# Altium project DepSwitches.PrjPCB
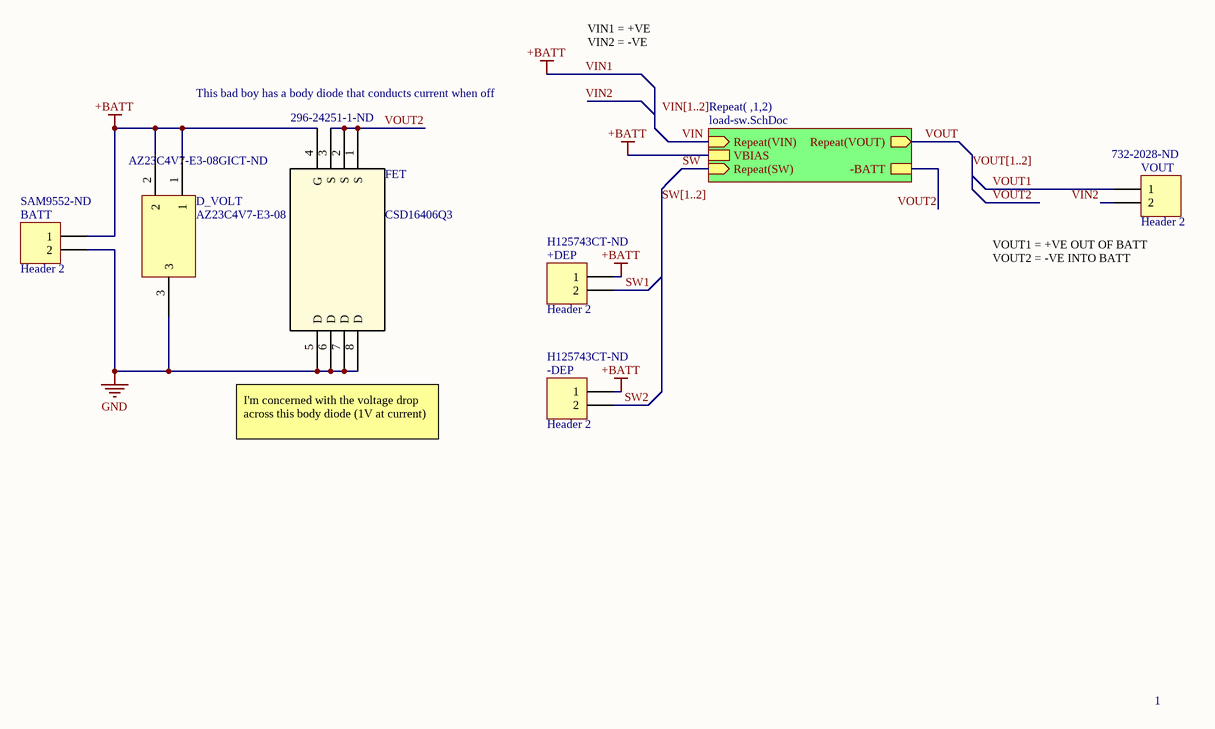
[diagram p0: dep-switches.SchDoc]
ProjectDrawnBy: Jaden Reimer; ProjectRevision: v1.0; ProjectSheetTotal: 2; ProjectTitle: Deployment Switch Prototype PCB
2 sheets, 20 parts. Net scope: hierarchical (ports join the sheet entries above them; power ports are global).
Board file: dep-switches.PcbDoc
Sheets:
  dep-switches.SchDoc
    1 = load-sw.SchDoc
    2 = load-sw.SchDoc

## Sheet dep-switches.SchDoc
size A4

### Parts
+DEP  Header 2  Supplier Part Number 1: H125743CT-ND  [DF13A-2P-1.25H(21)]
-DEP  Header 2  Supplier Part Number 1: H125743CT-ND  [DF13A-2P-1.25H(21)]
BATT  Header 2  [SAM9552-ND]
D_VOLT  AZ23C4V7-E3-08  Supplier Part Number 1: AZ23C4V7-E3-08GICT-ND
FET  CSD16406Q3  Supplier Part Number 1: 296-24251-1-ND  [CSD16406Q3]
VOUT  Header 2  Supplier Part Number 1: 732-2028-ND  [CON2_SCREW_5.00MM_691102710002]

### Sub-sheets
Repeat( ,1,2) = load-sw.SchDoc: Repeat(SW) (in), Repeat(VIN) (in), -BATT, Repeat(VOUT) (out), VBIAS

### Nets
GND: BATT.2 D_VOLT.3 FET.5(D) FET.6(D) FET.7(D) FET.8(D)
VIN1: +DEP.1 -DEP.1 BATT.1 D_VOLT.1 D_VOLT.2 FET.4(G) ; sheet Repeat( ,1,2)/VBIAS  [also labelled +BATT]
SW: sheet Repeat( ,1,2)/Repeat(SW)
SW1: +DEP.2
SW2: -DEP.2
VIN: sheet Repeat( ,1,2)/Repeat(VIN)
VIN2: VOUT.2
VOUT: sheet Repeat( ,1,2)/Repeat(VOUT)
VOUT1: VOUT.1
VOUT2: FET.1(S) FET.2(S) FET.3(S) ; sheet Repeat( ,1,2)/-BATT

### Buses and harness runs
bus SW[1..2]
bus VIN[1..2]
bus VOUT[1..2]

### Notes on the sheet
- This bad boy has a body diode that conducts current when off
- VIN1 = +VE
  VIN2 = -VE
- (near VOUT) VOUT1 = +VE OUT OF BATT
  VOUT2 = -VE INTO BATT
- I'm concerned with the voltage drop across this body diode (1V at current)
- 1
- Labels drawn without touching a wire or pin: VIN[1..2]

### Library data of the parts
+DEP -DEP = Header 2: Header, 2-Pin; Manufacturer: Hirose; Number of Positions: 2; Pitch: 1.25mm; LatestRevisionDate: 17-Jul-2002; LatestRevisionNote: Re-released for DXP Platform.; Publisher: Altium Limited; Supplier 1: Digi-Key; Manufacturer Part Number: DF13A-2P-1.25H(21); Stock 1: 4810; Pricing 1: 1=0.43, 10=0.403, 100=0.3087, 500=0.2684 (USD); Contact Material: Brass; Housing Material: Polyamide; Contact Gender: Male; Package Quantity: 1000; Number of Rows: 1; Packaging: Tape and Reel; Termination: SMD/SMT; Lead Free: Lead Free
BATT = Header 2: Header, 2-Pin; Manufacturer: Samtec; Manufacturer Part Number: IPBT-102-H1-T-S-RA-K; Number of Contacts: 2; Gender: Male; Pitch: 4.19mm; LatestRevisionDate: 17-Jul-2002; LatestRevisionNote: Re-released for DXP Platform.; Publisher: Altium Limited; Supplier 1: Digi-Key; Supplier Part Number 1: SAM9552-ND; Stock 1: 4351; Pricing 1: 1=1.39, 57=1.13298, 114=1.08149, 513=0.90125, 1026=0.7725, 5016=0.68495, 10032=0.6695 (USD); Mount: Through Hole; Packaging: Rail/Tube; Termination: Solder; Orientation: Right Angle; Radiation Hardening: No; ComponentLink1URL: http://www.samtec.com/documents/webfiles/pdf/ipbt.pdf?src-supplier=Avnet; ComponentLink1Description: http://www.samtec.com/documents/webfiles/pdf/ipbt.pdf?src-supplier=Avnet
D_VOLT = AZ23C4V7-E3-08: 300mW zener diode; Manufacturer: Vishay; Element Configuration: Common Anode; Zener Voltage: 4.7V; Impedance: 78R; Voltage Tolerance: 5%; Supplier 1: Digi-Key; Manufacturer Part Number: AZ23C4V7-E3-08; Stock 1: 7800; Pricing 1: 1=0.31, 10=0.255, 25=0.2132, 100=0.135, 250=0.10424, 500=0.08884, 1000=0.06041 (USD); Mount: Surface Mount; Case/Package: SOT-23; Number of Pins: 3; Weight: 0.00031oz; Min Operating Temperature: -55°C; Max Operating Temperature: 150°C; Packaging: Tape and Reel; Package Quantity: 3000; Max Power Dissipation: 300mW; Power Dissipation: 300mW; Tolerance: 5%; REACH SVHC: Unknown
FET = CSD16406Q3: Power MOSFET; Manufacturer: Texas Instruments; Rise Time: 12.9ns; Rds On Max: 5.3mR; Input Capacitance: 1.1nF; Nominal Vgs: 1.7V; Dual Supply Voltage: 25V; Continuous Drain Current (ID): 60A; Max Power Dissipation: 2.7W; Fall Time: 4.8ns; Turn-Off Delay Time: 8.5ns; Gate to Source Voltage (Vgs): 16V; Turn-On Delay Time: 7.3ns; Number of Elements: 1; Element Configuration: Single; Supplier 1: Digi-Key; Manufacturer Part Number: CSD16406Q3; Stock 1: 25901; Pricing 1: 1=1.16, 10=1.031, 100=0.8151, 500=0.63212, 1000=0.49904 (USD); Mount: Surface Mount; Case/Package: QFN; Number of Pins: 8; Contact Plating: Tin,Matte; Min Operating Temperature: -55°C; Max Operating Temperature: 150°C; Packaging: Tape and Reel; Package Quantity: 1; Drain to Source Voltage (Vdss): 25V; Drain to Source Breakdown Voltage: 25V; Power Dissipation: 2.7W; Termination: SMD/SMT; Threshold Voltage: 1.7V; Radiation Hardening: No; REACH SVHC: No SVHC; Lead Free: Contains Lead; ComponentLink1URL: http://www.ti.com/general/docs/lit/getliterature.tsp?genericPartNumber=CSD16406Q3&&fileType=pdf&src-supplier=Avnet; ComponentLink1Description: http://www.ti.com/general/docs/lit/getliterature.tsp?genericPartNumber=CSD16406Q3&&fileType=pdf&src-supplier=Avnet; ComponentLink2URL: http://www.ti.com/lit/ds/symlink/csd16406q3.pdf?src-supplier=Digi-Key; ComponentLink2Description: http://www.ti.com/lit/ds/symlink/csd16406q3.pdf?src-supplier=Digi-Key; ComponentLink3URL: http://www.mouser.com/ds/2/405/slps202a-128073.pdf?src-supplier=Mouser; ComponentLink3Description: http://www.mouser.com/ds/2/405/slps202a-128073.pdf?src-supplier=Mouser; ComponentLink4URL: http://www.farnell.com/datasheets/483980.pdf?src-supplier=Farnell; ComponentLink4Description: http://www.farnell.com/datasheets/483980.pdf?src-supplier=Farnell; ComponentLink5URL: http://www.ti.com/general/docs/lit/getliterature.tsp?genericPartNumber=CSD16406Q3&amp;&amp;fileType=pdf&src-supplier=Farnell; ComponentLink5Description: http://www.ti.com/general/docs/lit/getliterature.tsp?genericPartNumber=CSD16406Q3&amp;&amp;fileType=pdf&src-supplier=Farnell; ComponentLink6URL: http://www.farnell.com/simulation/1744921.zip?src-supplier=Element14; ComponentLink6Description: http://www.farnell.com/simulation/1744921.zip?src-supplier=Element14
VOUT = Header 2: Header, 2-Pin; Manufacturer: Wurth Electronics; Manufacturer Part Number: 691102710002; Plating: Steel; Voltage Rating: 300V; Current Rating: 15A; Number of Levels: 1; Number of Positions Per Level: 2; Wire/Cable Gauge: 22AWG; Wire Gauge (Min): 14AWG; Pitch: 0.197inch; Stripping Length: -6mm; LatestRevisionDate: 17-Jul-2002; LatestRevisionNote: Re-released for DXP Platform.; Publisher: Altium Limited; Supplier 1: Digi-Key; Stock 1: 735; Pricing 1: 1=0.69, 10=0.616, 50=0.532, 100=0.5 (USD); Mount: Through Hole; Contact Material: Brass; Color: Blue; Contact Plating: Tin; Housing Material: Nylon; Min Operating Temperature: -40°C; Max Operating Temperature: 105°C; Package Quantity: 900; Packaging: Bulk; Current: 15A; Voltage: 300V; Termination: Screw; Number of Contacts: 2; Length: 7.5mm; Height: 13.4mm; Width: 11.2mm; Wire Gauge (Max): 22AWG; REACH SVHC: Unknown; ComponentLink1URL: https://katalog.we-online.de/em/datasheet/6911027100xx.pdf?src-supplier=Digi-Key; ComponentLink1Description: https://katalog.we-online.de/em/datasheet/6911027100xx.pdf?src-supplier=Digi-Key; ComponentLink2URL: http://www.produktinfo.conrad.com/datenblaetter/1000000-1099999/001088592-da-01-en-WR_TBL_TERMINAL_BLOCK102_691102710002.pdf?src-supplier=Conrad; ComponentLink2Description: http://www.produktinfo.conrad.com/datenblaetter/1000000-1099999/001088592-da-01-en-WR_TBL_TERMINAL_BLOCK102_691102710002.pdf?src-supplier=Conrad

## Sheet load-sw.SchDoc
size A4
Used 2 times, as channels 1, 2. Parts and nets are listed once, with the designators drawn on the sheet.
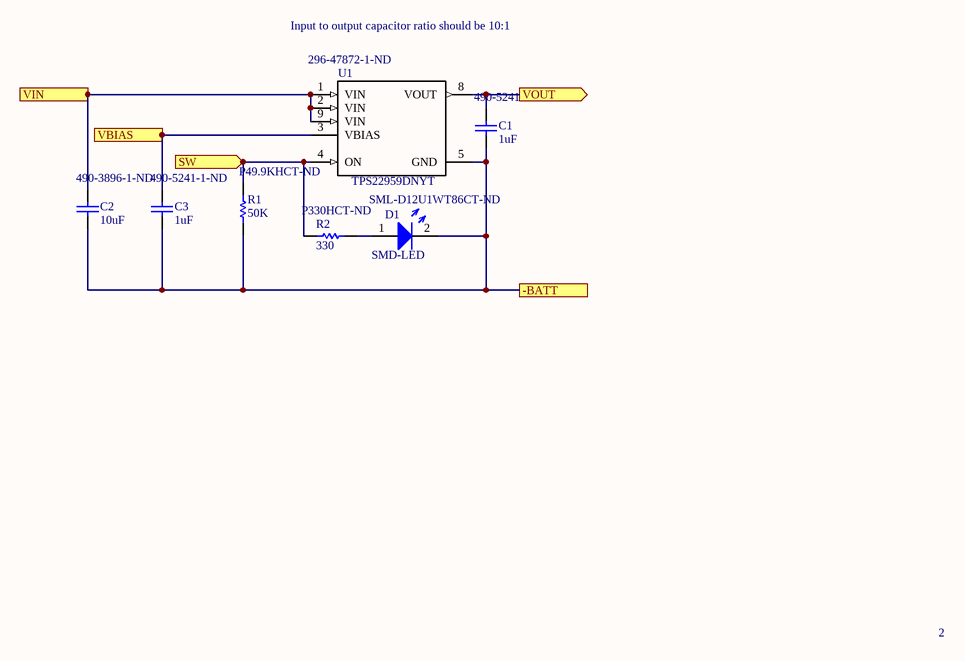
[diagram p1: load-sw.SchDoc]

### Parts
C1  1uF  Supplier Part Number 1: 490-5241-1-ND  [1608[0603]]
C2  10uF  Supplier Part Number 1: 490-3896-1-ND  [1608[0603]]
C3  1uF  Supplier Part Number 1: 490-5241-1-ND  [1608[0603]]
D1  SMD-LED  Supplier Part Number 1: SML-D12U1WT86CT-ND  [0603-LED]
R1  50K  Supplier Part Number 1: P49.9KHCT-ND  [1608[0603]]
R2  330  Supplier Part Number 1: P330HCT-ND  [1608[0603]]
U1  TPS22959DNYT  Supplier Part Number 1: 296-47872-1-ND  [TPS22959DNYT]

### Ports
-BATT, SW (in), VBIAS, VIN (in), VOUT (out)

### Nets
-BATT: C1.1 C2.1 C3.1 D1.2 R1.1 U1.5(GND) ; port -BATT
SW: R1.2 R2.2 U1.4(ON) ; port SW
VBIAS: C3.2 U1.3(VBIAS) ; port VBIAS
VIN: C2.2 U1.1(VIN) U1.2(VIN) U1.9(VIN) ; port VIN
VOUT: C1.2 U1.8(VOUT) ; port VOUT
NetD1_1: D1.1 R2.1

### Channels
1: designators end in _1; ports -BATT=VOUT2 SW=SW1 VBIAS=VIN1 VIN=VIN1 VOUT=VOUT1
2: designators end in _2; ports -BATT=VOUT2 SW=SW2 VBIAS=VIN1 VIN=VIN2 VOUT=VOUT2

### Notes on the sheet
- Input to output capacitor ratio should be 10:1
- 2

### Library data of the parts
C1 C3 = Cap Semi: Capacitor (Semiconductor SIM Model); Manufacturer: Murata; Manufacturer Part Number: GCM188R71C105KA64D; Description: CAP CER 1UF 16V X7R 0603; Tolerance: 10%; Voltage Rating: 16V; Dielectric: X7R; Published: 8-Jun-2000; LatestRevisionDate: 29-May-2009; LatestRevisionNote: IPC-7351 Footprint Added.; PackageReference: C1206; Publisher: Altium Limited; PackageDescription: Chip Capacitor; Value: 1uF; Supplier 1: Digi-Key; Stock 1: 377297; Pricing 1: 1=0.34, 10=0.235, 100=0.1412, 500=0.10588, 1000=0.08941 (USD); Mount: Surface Mount; Case/Package: 0603; Case Code (Metric): 1608; Case Code (Imperial): 0603; Min Operating Temperature: -55°C; Max Operating Temperature: 125°C; Capacitance: 1uF; Packaging: Tape and Reel; Package Quantity: 1; Voltage Rating (DC): 16V; Termination: SMD/SMT; Voltage: 16V; Length: 1.6mm; Height: 0.8mm; Width: 0.031inch; Thickness: 0.035inch; Depth: 0.8mm; Ratings: AEC-Q200; Radiation Hardening: No; REACH SVHC: No SVHC; Lead Free: Lead Free; ComponentLink1URL: http://psearch.murata.com/capacitor/product/GCM188R71C105KA64%23.pdf?src-supplier=Avnet; ComponentLink1Description: http://psearch.murata.com/capacitor/product/GCM188R71C105KA64%23.pdf?src-supplier=Avnet; ComponentLink2URL: http://www.murata.com/products/catalog/pdf/c03e.pdf?src-supplier=Future+Electronics; ComponentLink2Description: http://www.murata.com/products/catalog/pdf/c03e.pdf?src-supplier=Future+Electronics; ComponentLink3URL: http://search.murata.co.jp/Ceramy/image/img/A01X/partnumbering_e_02.pdf?src-supplier=Digi-Key; ComponentLink3Description: http://search.murata.co.jp/Ceramy/image/img/A01X/partnumbering_e_02.pdf?src-supplier=Digi-Key; ComponentLink4URL: https://www.murata.com/~/media/webrenewal/support/library/catalog/products/capacitor/mlcc/c03e.ashx?la=en-us&src-supplier=Digi-Key; ComponentLink4Description: https://www.murata.com/~/media/webrenewal/support/library/catalog/products/capacitor/mlcc/c03e.ashx?la=en-us&src-supplier=Digi-Key; ComponentLink5URL: http://psearch.murata.com/capacitor/product/GCM188R71C105KA64%23.pdf?src-supplier=Avnet+Europe; ComponentLink5Description: http://psearch.murata.com/capacitor/product/GCM188R71C105KA64%23.pdf?src-supplier=Avnet+Europe
C2 = Cap Semi: Capacitor (Semiconductor SIM Model); Manufacturer: Murata; Manufacturer Part Number: GRM188R60J106ME47D; Description: CAP CER 10UF 6.3V X5R 0603; Material: Ceramic; Tolerance: 20%; Dielectric: X5R; Voltage Rating: 6.3V; Published: 8-Jun-2000; LatestRevisionDate: 29-May-2009; LatestRevisionNote: IPC-7351 Footprint Added.; PackageReference: C1206; Publisher: Altium Limited; PackageDescription: Chip Capacitor; Value: 10uF; Supplier 1: Digi-Key; Stock 1: 21037979; Pricing 1: 1=0.37, 10=0.259, 100=0.1553, 500=0.11644, 1000=0.09833 (USD); Mount: Surface Mount; Case/Package: 0603; Case Code (Metric): 1608; Case Code (Imperial): 0603; Min Operating Temperature: -55°C; Max Operating Temperature: 85°C; Capacitance: 10uF; Packaging: Tape and Reel; Package Quantity: 4000; Voltage Rating (DC): 6.3V; Termination: SMD/SMT; Voltage: 6.3V; Length: 1.6mm; Height: 0.8mm; Width: 0.031inch; Thickness: 0.035inch; Depth: 0.8mm; Radiation Hardening: No; REACH SVHC: No SVHC; Lead Free: Lead Free; ComponentLink1URL: https://www.murata.com/~/media/webrenewal/support/library/catalog/products/capacitor/mlcc/c02e.ashx?la=en-us&src-supplier=Digi-Key; ComponentLink1Description: https://www.murata.com/~/media/webrenewal/support/library/catalog/products/capacitor/mlcc/c02e.ashx?la=en-us&src-supplier=Digi-Key; ComponentLink2URL: http://www.farnell.com/datasheets/2047842.pdf?src-supplier=Farnell; ComponentLink2Description: http://www.farnell.com/datasheets/2047842.pdf?src-supplier=Farnell; ComponentLink3URL: http://components.arrow.com/part/dataview/43432894S8110083N2606?src-supplier=Arrow; ComponentLink3Description: http://components.arrow.com/part/dataview/43432894S8110083N2606?src-supplier=Arrow; ComponentLink4URL: http://www.farnell.com/datasheets/415295.pdf?src-supplier=Element14; ComponentLink4Description: http://www.farnell.com/datasheets/415295.pdf?src-supplier=Element14; ComponentLink5URL: https://www.murata.com/~/media/webrenewal/support/library/catalog/products/capacitor/mlcc/c02e.ashx?src-supplier=Distrelec; ComponentLink5Description: https://www.murata.com/~/media/webrenewal/support/library/catalog/products/capacitor/mlcc/c02e.ashx?src-supplier=Distrelec; ComponentLink6URL: http://search.murata.co.jp/Ceramy/image/img/w_hinm/L0005E.pdf?src-supplier=Future+Electronics; ComponentLink6Description: http://search.murata.co.jp/Ceramy/image/img/w_hinm/L0005E.pdf?src-supplier=Future+Electronics; ComponentLink7URL: http://www.produktinfo.conrad.com/datenblaetter/450000-474999/450781-da-01-de-VS_CHIP_KOND_0603_10_0_UF_20Pr_6_3V_X5R.pdf?src-supplier=Conrad; ComponentLink7Description: http://www.produktinfo.conrad.com/datenblaetter/450000-474999/450781-da-01-de-VS_CHIP_KOND_0603_10_0_UF_20Pr_6_3V_X5R.pdf?src-supplier=Conrad; ComponentLink8URL: http://www.produktinfo.conrad.com/datenblaetter/450000-474999/454401-da-01-en-VS_KONDENSATOR_0603.pdf?src-supplier=Conrad; ComponentLink8Description: http://www.produktinfo.conrad.com/datenblaetter/450000-474999/454401-da-01-en-VS_KONDENSATOR_0603.pdf?src-supplier=Conrad
D1 = LED: Just a generic LED; Manufacturer: Rohm; Manufacturer Part Number: SML-D12U1WT86; Description: LED RED DIFFUSED 1608 SMD; Color: Red; Lens Color: White; Lens Transparency: Diffused; Luminous Intensity: 63mcd; Test Current: 20mA; Dominant Wavelength: 620nm; Forward Voltage: 2.2V; Supplier 1: Digi-Key; Stock 1: 100645; Pricing 1: 1=0.22, 10=0.162, 25=0.1192, 100=0.0853, 250=0.05796, 500=0.05116, 1000=0.04007 (USD); Mount: Surface Mount; Case/Package: 0603; Case Code (Metric): 1608; Case Code (Imperial): 0603; Packaging: Tape and Reel; Length: 1.6mm; Height: 0.65mm; Width: 0.8mm; Lead Free: Lead Free
R1 = Res1: Resistor; Manufacturer: Panasonic; Manufacturer Part Number: ERJ3EKF4992V; Description: RES SMD 49.9K OHM 1% 1/10W 0603; Power Rating: 100mW; Tolerance: 1%; Resistance: 49.9kR; Voltage Rating: 75V; Temperature Coefficient: 100ppm/°C; Voltage Rating (DC): 50V; Published: 8-Jun-2000; LatestRevisionDate: 17-Jul-2002; LatestRevisionNote: Re-released for DXP Platform.; PackageReference: AXIAL-0.3; Publisher: Altium Limited; PackageDescription: Axial Device, Thru-Hole; 2 Leads; 0.3 in Pin Spacing; Value: 50K; Supplier 1: Digi-Key; Stock 1: 454779; Pricing 1: 1=0.1, 10=0.065, 100=0.0264, 1000=0.01186, 2500=0.01029 (USD); Mount: Surface Mount; Case/Package: 0603; Weight: 7.1E-05oz; Case Code (Metric): 1608; Case Code (Imperial): 0603; Contact Plating: Tin; Min Operating Temperature: -55°C; Max Operating Temperature: 155°C; Packaging: Tape and Reel; Package Quantity: 1; Composition: Thick Film; Termination: SMD/SMT; Number of Terminations: 2; Military Standard: Not; Max Power Dissipation: 100mW; Features: Automotive AEC-Q200; Length: 1.6mm; Height: 0.45mm; Width: 0.8mm; Depth: 0.8mm; Radiation Hardening: No; REACH SVHC: No SVHC; Lead Free: Lead Free; ComponentLink1URL: http://www.farnell.com/datasheets/1911175.pdf?src-supplier=Farnell; ComponentLink1Description: http://www.farnell.com/datasheets/1911175.pdf?src-supplier=Farnell; ComponentLink2URL: http://www.farnell.com/datasheets/1911175.pdf?src-supplier=Element14; ComponentLink2Description: http://www.farnell.com/datasheets/1911175.pdf?src-supplier=Element14; ComponentLink3URL: http://industrial.panasonic.com/www-data/pdf/AOA0000/AOA0000CE2.pdf?src-supplier=Future+Electronics; ComponentLink3Description: http://industrial.panasonic.com/www-data/pdf/AOA0000/AOA0000CE2.pdf?src-supplier=Future+Electronics; ComponentLink4URL: http://industrial.panasonic.com/www-data/pdf/AOA0000/AOA0000CE2.pdf?src-supplier=Avnet+Europe; ComponentLink4Description: http://industrial.panasonic.com/www-data/pdf/AOA0000/AOA0000CE2.pdf?src-supplier=Avnet+Europe; ComponentLink5URL: http://industrial.panasonic.com/www-data/pdf/AOA0000/AOA0000CE2.pdf?src-supplier=Avnet; ComponentLink5Description: http://industrial.panasonic.com/www-data/pdf/AOA0000/AOA0000CE2.pdf?src-supplier=Avnet; ComponentLink6URL: http://www.farnell.com/datasheets/1678782.pdf?src-supplier=Element14; ComponentLink6Description: http://www.farnell.com/datasheets/1678782.pdf?src-supplier=Element14; ComponentLink7URL: https://www.verical.com/server-webapp/html/getDatasheet?partID=52039&src-supplier=Verical; ComponentLink7Description: https://www.verical.com/server-webapp/html/getDatasheet?partID=52039&src-supplier=Verical; ComponentLink8URL: http://www.jameco.com/Jameco/Products/ProdDS/1988209.pdf?src-supplier=Jameco; ComponentLink8Description: http://www.jameco.com/Jameco/Products/ProdDS/1988209.pdf?src-supplier=Jameco
R2 = Res1: Resistor; Manufacturer: Panasonic; Manufacturer Part Number: ERJ3EKF3300V; Description: RES SMD 330 OHM 1% 1/10W 0603; Tolerance: 1%; Resistance: 330R; Power Rating: 100mW; Voltage Rating: 75V; Temperature Coefficient: 100ppm/°C; Published: 8-Jun-2000; LatestRevisionDate: 17-Jul-2002; LatestRevisionNote: Re-released for DXP Platform.; PackageReference: AXIAL-0.3; Publisher: Altium Limited; PackageDescription: Axial Device, Thru-Hole; 2 Leads; 0.3 in Pin Spacing; Value: 330; Supplier 1: Digi-Key; Stock 1: 2611011; Pricing 1: 1=0.1, 10=0.065, 100=0.0264, 1000=0.01186, 2500=0.01029 (USD); Mount: Surface Mount; Case/Package: 0603; Number of Pins: 2; Weight: 7.1E-05oz; Case Code (Imperial): 0603; Case Code (Metric): 1608; Contact Plating: Tin; Min Operating Temperature: -55°C; Max Operating Temperature: 155°C; Packaging: Tape and Reel; Package Quantity: 5000; Composition: Thick Film; Termination: SMD/SMT; Number of Terminations: 2; Military Standard: Not; Max Power Dissipation: 100mW; Voltage Rating (DC): 75V; Features: Automotive AEC-Q200; Length: 1.6mm; Height: 0.45mm; Width: 0.8mm; Depth: 0.8mm; Radiation Hardening: No; REACH SVHC: No SVHC; Lead Free: Lead Free; ComponentLink1URL: http://www.farnell.com/datasheets/1911175.pdf?src-supplier=Element14; ComponentLink1Description: http://www.farnell.com/datasheets/1911175.pdf?src-supplier=Element14; ComponentLink2URL: https://industrial.panasonic.com/cdbs/www-data/pdf/RDA0000/DMA0000COL11.pdf?src-supplier=Avnet; ComponentLink2Description: https://industrial.panasonic.com/cdbs/www-data/pdf/RDA0000/DMA0000COL11.pdf?src-supplier=Avnet; ComponentLink3URL: http://www.farnell.com/datasheets/426256.pdf?src-supplier=Element14; ComponentLink3Description: http://www.farnell.com/datasheets/426256.pdf?src-supplier=Element14
U1 = TPS22959DNYT: 5.5V, 15A, 4.4mÎ© Load Switch with Quick Output Discharge 8-WSON -40 to 85; MF: Texas Instruments; Number of Outputs: 1; Quiescent Current: 20.4uA; Package: WSON-8 Texas Instruments; Digi-Key_Part_Number: 296-47872-1-ND; Digi-Key_Purchase_URL: https://www.digikey.ca/product-detail/en/texas-instruments/TPS22959DNYT/296-47872-1-ND/8133221?utm_source=snapeda&utm_medium=aggregator&utm_campaign=symbol; SnapEDA_Link: https://www.snapeda.com/parts/TPS22959DNYT/Texas%20Instruments/view-part/?ref=snap; MP: TPS22959DNYT; Value: *; Supplier 1: Digi-Key; Manufacturer: Texas Instruments; Manufacturer Part Number: TPS22959DNYT; Stock 1: 2432; Pricing 1: 1=1.91, 10=1.711, 100=1.3756 (USD); Mount: Surface Mount; Number of Pins: 8; Min Operating Temperature: -40°C; Max Operating Temperature: 85°C; Number of Channels: 1; Lead Free: Lead Free; ComponentLink1URL: http://www.ti.com/general/docs/lit/getliterature.tsp?genericPartNumber=TPS22959&&fileType=pdf&src-supplier=Avnet; ComponentLink1Description: http://www.ti.com/general/docs/lit/getliterature.tsp?genericPartNumber=TPS22959&&fileType=pdf&src-supplier=Avnet

## Nets that join several sheets
VIN1: dep-switches (6 pins), 1 (6 pins), 2 (C3_2.2 U1_2.3)
SW1: dep-switches (+DEP.2), 1 (R1_1.2 R2_1.2 U1_1.4)
SW2: dep-switches (-DEP.2), 2 (R1_2.2 R2_2.2 U1_2.4)
VIN2: dep-switches (VOUT.2), 2 (C2_2.2 U1_2.1 U1_2.2 U1_2.9)
VOUT1: dep-switches (VOUT.1), 1 (C1_1.2 U1_1.8)
VOUT2: dep-switches (FET.1 FET.2 FET.3), 1 (6 pins), 2 (8 pins)